# EAGLE design a111-fader (EAGLE 7.6.0)
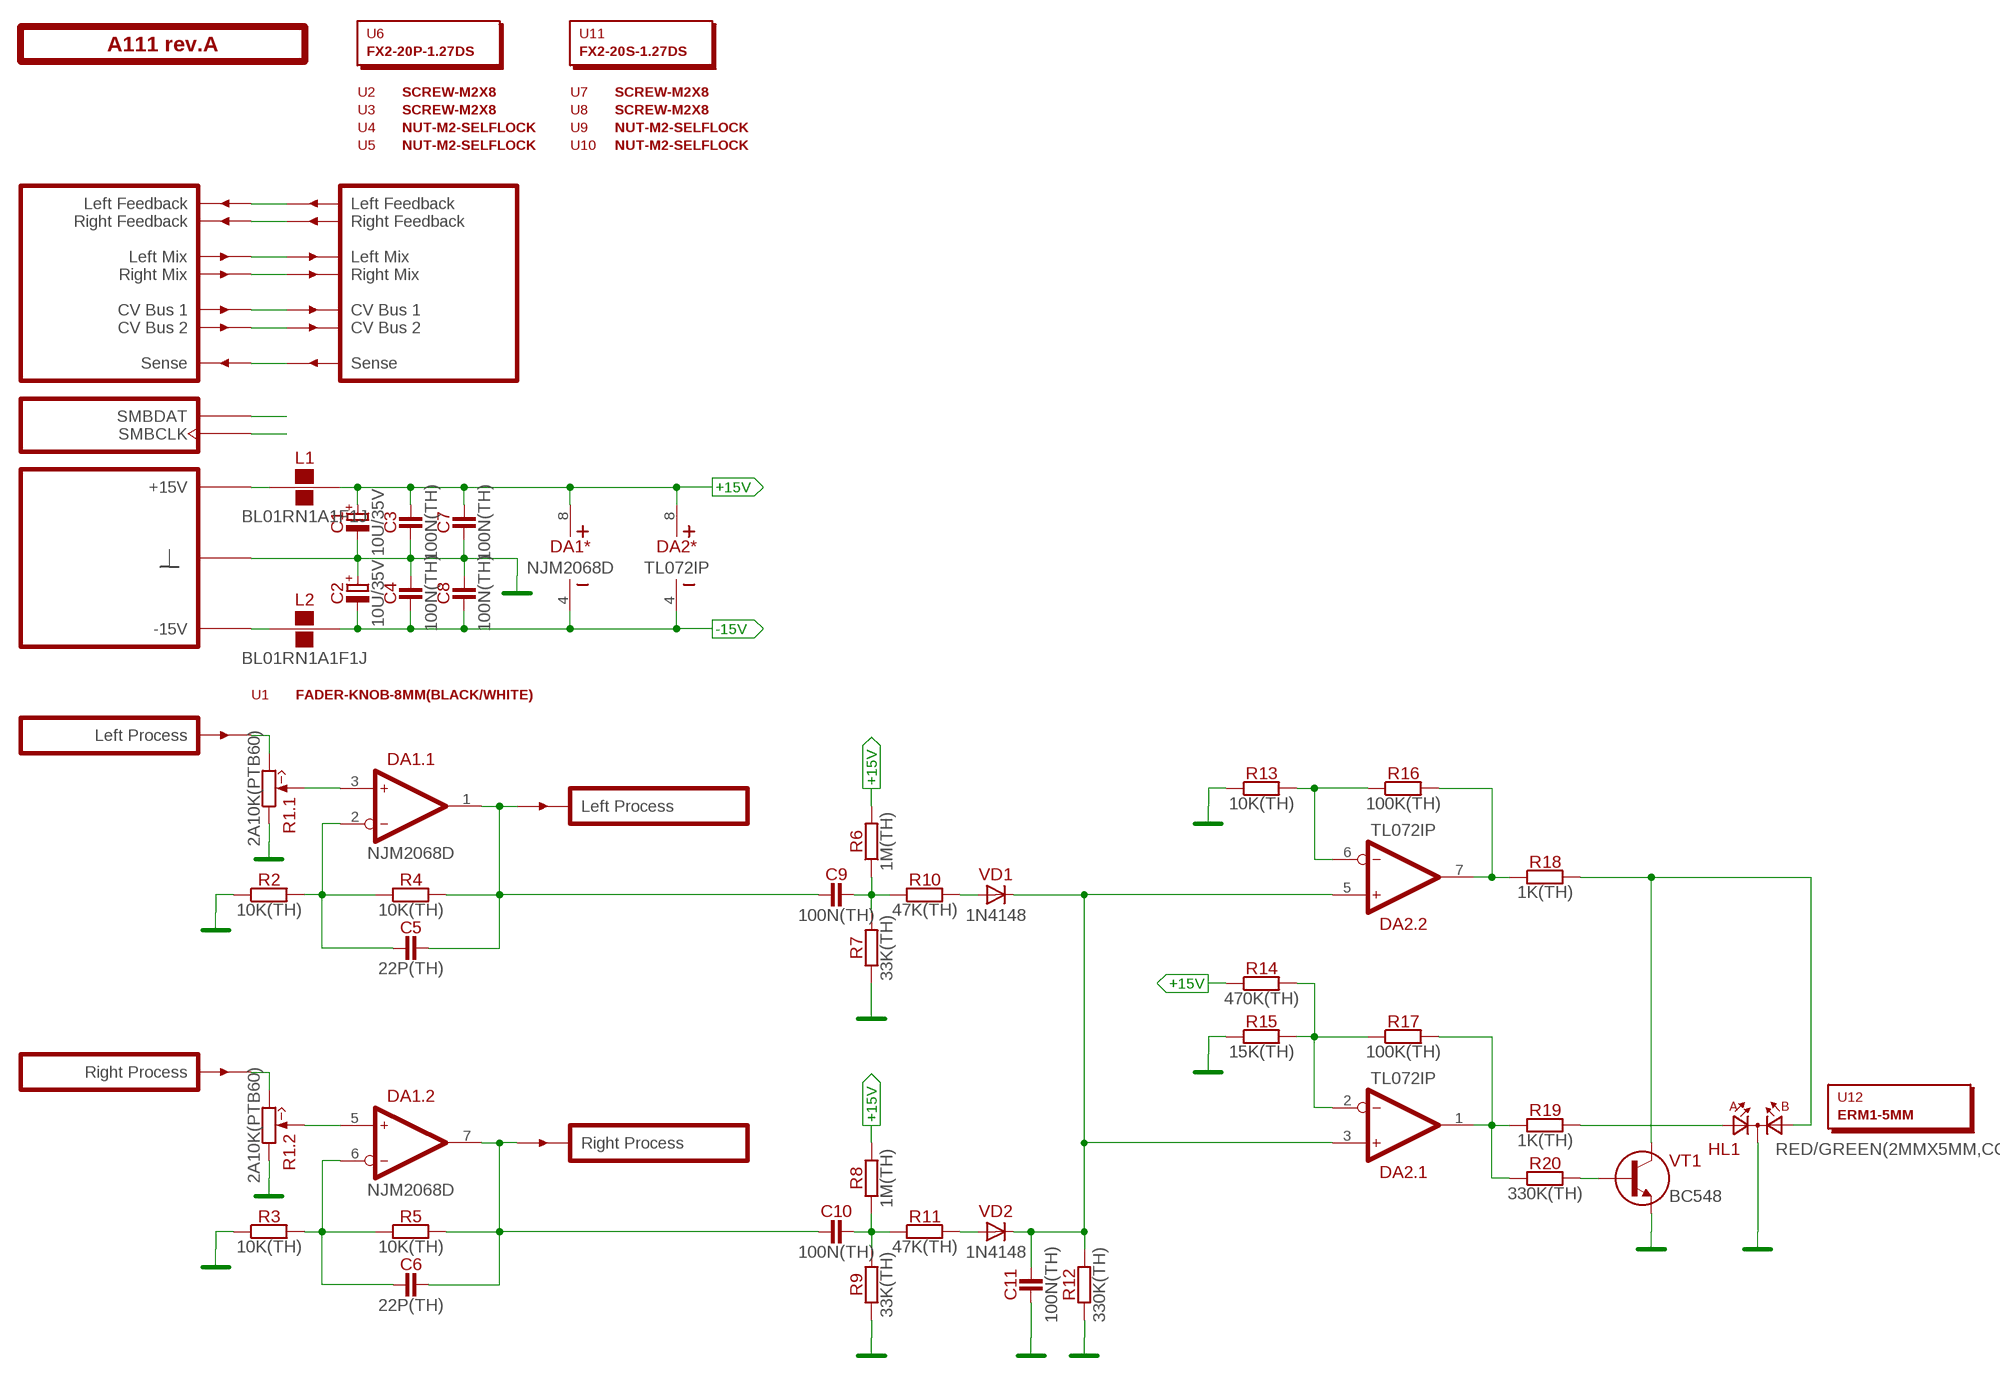
[diagram p0: schematic, sheet 1]

## Parts
C1  10U/35V  [E2-5]
C2  10U/35V  [E2-5]
C3  100N(TH)  [C050-024X044]
C4  100N(TH)  [C050-024X044]
C5  22P(TH)  [C050-024X044]
C6  22P(TH)  [C050-024X044]
C7  100N(TH)  [C050-024X044]
C8  100N(TH)  [C050-024X044]
C9  100N(TH)  [C050-024X044]
C10  100N(TH)  [C050-024X044]
C11  100N(TH)  [C050-024X044]
DA1  NJM2068D  [DIP-8]
DA2  TL072IP  [DIP-8]
HL1  RED/GREEN(2MMX5MM,CC)  [LED2X5-3PIN]
L1  BL01RN1A1F1J  [BL01RN1A]
L2  BL01RN1A1F1J  [BL01RN1A]
PCB1  A111 rev.A  ST2-BOARD-50  [ST2-BOARD-50]
R1  2A10K(PTB60)  [PTB6044]
R2  10K(TH)  [R-0207/10]
R3  10K(TH)  [R-0207/10]
R4  10K(TH)  [R-0207/10]
R5  10K(TH)  [R-0207/10]
R6  1M(TH)  [R-0207/10]
R7  33K(TH)  [R-0207/10]
R8  1M(TH)  [R-0207/10]
R9  33K(TH)  [R-0207/10]
R10  47K(TH)  [R-0207/10]
R11  47K(TH)  [R-0207/10]
R12  330K(TH)  [R-0207/10]
R13  10K(TH)  [R-0207/10]
R14  470K(TH)  [R-0207/10]
R15  15K(TH)  [R-0207/10]
R16  100K(TH)  [R-0207/10]
R17  100K(TH)  [R-0207/10]
R18  1K(TH)  [R-0207/10]
R19  1K(TH)  [R-0207/10]
R20  330K(TH)  [R-0207/10]
U1  FADER-KNOB-8MM(BLACK/WHITE)  [EMPTY]
U2  SCREW-M2X8  [EMPTY]
U3  SCREW-M2X8  [EMPTY]
U4  NUT-M2-SELFLOCK  [EMPTY]
U5  NUT-M2-SELFLOCK  [EMPTY]
U6  FX2-20P-1.27DS  [EMPTY]
U7  SCREW-M2X8  [EMPTY]
U8  SCREW-M2X8  [EMPTY]
U9  NUT-M2-SELFLOCK  [EMPTY]
U10  NUT-M2-SELFLOCK  [EMPTY]
U11  FX2-20S-1.27DS  [EMPTY]
U12  ERM1-5MM  [EMPTY]
VD1  1N4148  [DO35-7]
VD2  1N4148  [DO35-7]
VT1  BC548  [TO92]

## Nets
+15V [power]: C1.+ C3.2 C7.2 DA1.8(*:V+) DA2.8(*:V+) L1.2 R6.2 R8.2 R14.1
-15V: C2.- C4.1 C8.1 DA1.4(*:V-) DA2.4(*:V-) L2.2
GND: C1.- C2.+ C3.1 C4.2 C7.1 C8.2 C11.1 HL1.K PCB1.B4'(GND) PCB1.B4(GND) PCB1.B5'(GND) PCB1.B5(GND) PCB1.B6'(GND) PCB1.B6(GND) PCB1.B7'(GND) PCB1.B7(GND) PCB1.B8'(GND) PCB1.B8(GND) R1.A1(.1:CCW) R1.B1(.2:CCW) R2.1 R3.1 R7.1 R9.1 R12.1 R13.1 R15.1 VT1.3(E)
N$1: PCB1.ALFBK'(LFBK') PCB1.ALFBK(LFBK)
N$2: PCB1.ARFBK'(RFBK') PCB1.ARFBK(RFBK)
N$3: PCB1.ALMIX'(LMIX') PCB1.ALMIX(LMIX)
N$4: PCB1.ARMIX'(RMIX') PCB1.ARMIX(RMIX)
N$5: PCB1.ACV1'(CV1') PCB1.ACV1(CV1)
N$6: PCB1.ACV2'(CV2') PCB1.ACV2(CV2)
N$7: PCB1.BSENSE'(SENSE') PCB1.BSENSE(SENSE)
N$8: PCB1.ASMBDAT'(SMBDAT) PCB1.ASMBDAT(SMBDAT)
N$9: PCB1.ASMBCLK'(SMBCLK) PCB1.ASMBCLK(SMBCLK)
N$10: PCB1.BINL(INL) R1.A3(.1:CW)
N$11: DA1.3(.1:IN+) R1.A2(.1:W)
N$12: C5.1 DA1.2(.1:IN-) R2.2 R4.1
N$13: DA2.6(.2:IN-) R13.2 R16.1
N$14: PCB1.BINR(INR) R1.B3(.2:CW)
N$15: DA1.5(.2:IN+) R1.B2(.2:W)
N$16: C6.1 DA1.6(.2:IN-) R3.2 R5.1
N$17: DA2.7(.2:OUT) R16.2 R18.1
N$18: C6.2 C10.1 DA1.7(.2:OUT) PCB1.BOUTR'(OUTR) R5.2
N$19: C5.2 C9.1 DA1.1(.1:OUT) PCB1.BOUTL'(OUTL) R4.2
N$20: C9.2 R6.1 R7.2 R10.1
N$21: R10.2 VD1.A
N$22: C10.2 R8.1 R9.2 R11.1
N$23: R11.2 VD2.A
N$24: C11.2 DA2.3(.1:IN+) DA2.5(.2:IN+) R12.2 VD1.C VD2.C
N$25: L1.1 PCB1.A+15'(P+15V) PCB1.A+15(P+15V) PCB1.B+15'(P+15V) PCB1.B+15(P+15V)
N$29: HL1.A2 R18.2 VT1.1(C)
N$30: DA2.2(.1:IN-) R14.2 R15.2 R17.1
N$31: DA2.1(.1:OUT) R17.2 R19.1 R20.1
N$32: R20.2 VT1.2(B)
N$33: HL1.A1 R19.2
N$46: L2.1 PCB1.A-15'(P-15V) PCB1.A-15(P-15V) PCB1.B-15'(P-15V) PCB1.B-15(P-15V)

## Library data of the parts
C1 C2 = capacitors-electrolytic:?; MOUSER: 647-USW1V100MDD
C3 C4 C7-C11 = capacitors:?; MOUSER: 81-RCER71H104K0A2H3B
C5 C6 = capacitors:?
DA1 = ic-jrc:NJM2068; MOUSER: 513-NJM2068D
DA2 = ic-ti:TL072; MOUSER: 595-TL072IP
HL1 = optoelectronics:?(2MMX5MM,CC)
L1 L2 = inductors:BL01RN1A?; MOUSER: 81-BL01RN1A1F1J
PCB1 = module-footprints:ST2-BOARD-?
R1 = potentiometers:2**?(PTB60)
R2-R5 R13 = resistors:?; MOUSER: 71-RN55D-F-10K
R6-R12 R14 R15 R20 = resistors:?
R16 R17 = resistors:?; MOUSER: 71-RN55D-F-100K
R18 R19 = resistors:?; MOUSER: 71-RN55D-F-1.0K
U1-U5 U7-U10 = hardware:*?
U6 = hardware:?; MOUSER: 798-FX2-20P-1.27DS71
U11 = hardware:?; MOUSER: 798-FX2-20S-1.27DS71
U12 = hardware:?
VD1 VD2 = diodes:?; MOUSER: 583-1N4148-T
VT1 = transistors-npn:?

## Board
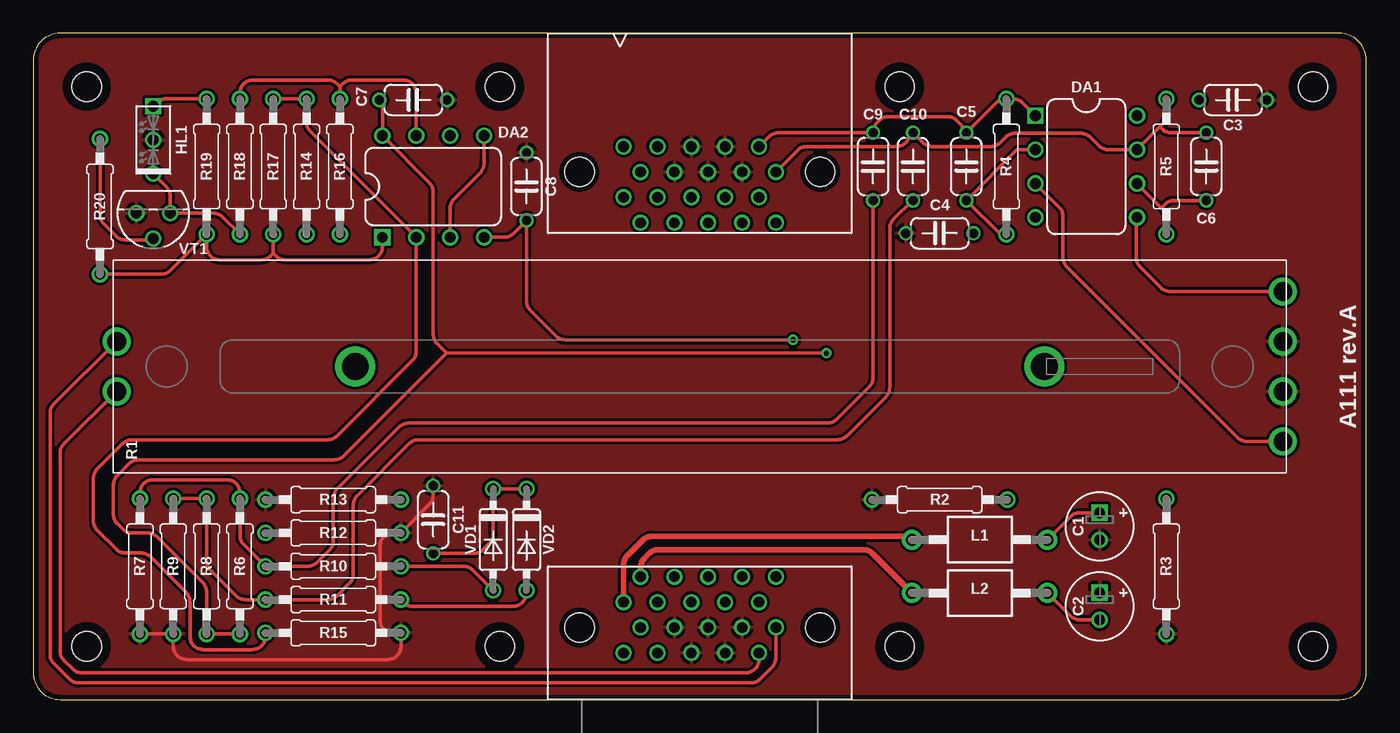
[diagram p1: board, top side]
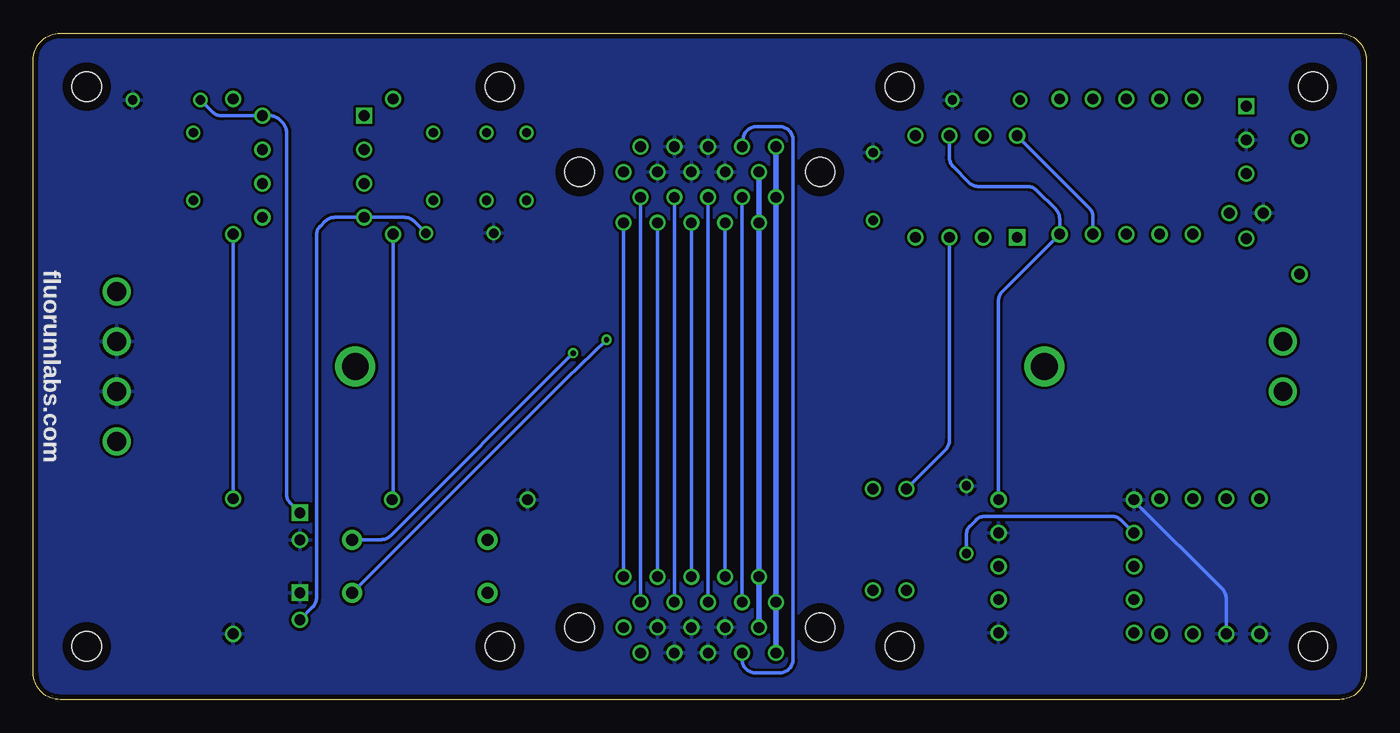
[diagram p2: board, bottom side, seen from below]

Size 100 x 50 mm. Coordinates in mm from the lower left corner, seen from the top.
Outline: 0,48 0,2 arc90 2,0 98,0 arc90 100,2 100,48 arc90 98,50 2,50 arc90 0,48
Copper layers (1*16): Top 0.0356mm / dielectric 1.5011mm / Bottom 0.0356mm
Design rules "sonictrain": minimum track width 6mil, minimum drill 13mil, track to track 8mil, track to pad 8mil, pad to pad 6mil, via to via 6mil, smd to smd 6mil, copper to edge 15mil, drill to drill 6mil, minimum pad ring 7mil, minimum via ring 7mil, stop-mask expansion 3mil, vias tented up to drill 25mil, thermal gap 10mil

### Footprints (pad centres in the part's own frame; a part is rotated, then mirrored left to right if it is on the bottom)
E2-5 = drill 0.813 square: + -1.016,0 | drill 0.813: - 1.016,0
C050-024X044 = drill 0.7: 1 -2.54,0; 2 2.54,0
DIP-8 = drill 0.813 square: 1 -3.81,-3.81 | drill 0.813: 2 -1.27,-3.81; 3 1.27,-3.81; 4 3.81,-3.81; 5 3.81,3.81; 6 1.27,3.81; 7 -1.27,3.81; 8 -3.81,3.81
LED2X5-3PIN = drill 0.813 square: A1 -2.54,0 | drill 0.813: A2 2.54,0; K 0,0
BL01RN1A = drill 0.9 pad 1.5: 1 -5.08,0; 2 5.08,0
ST2-BOARD-50 = drill 0.8: A+15 44.285,7.31; A+15' 44.285,37.69; A-15 45.555,9.215; A-15' 45.555,35.785; ACV1 51.905,7.31; ACV1' 51.905,37.69; ACV2 53.175,9.215; ACV2' 53.175,35.785; ALFBK 49.365,7.31; ALFBK' 49.365,37.69; ALMIX 46.825,7.31; ALMIX' 46.825,37.69; ARFBK 50.635,9.215; ARFBK' 50.635,35.785; ARMIX 48.095,9.215; ARMIX' 48.095,35.785; ASMBCLK 55.715,9.215; ASMBCLK' 55.715,35.785; ASMBDAT 54.445,7.31; ASMBDAT' 54.445,37.69; B4 48.095,5.405; B4' 48.095,39.595; B5 49.365,3.5; B5' 49.365,41.5; B6 50.635,5.405; B6' 50.635,39.595; B7 51.905,3.5; B7' 51.905,41.5; B8 53.175,5.405; B8' 53.175,39.595; B+15 44.285,3.5; B+15' 44.285,41.5; B-15 45.555,5.405; B-15' 45.555,39.595; BINL 54.445,3.5; BINR 55.715,5.405; BOUTL' 54.445,41.5; BOUTR' 55.715,39.595; BSENSE 46.825,3.5; BSENSE' 46.825,41.5 | hole 2.2: 4,4; 4,46; 96,4; 96,46; 35,46; 65,46; 65,4; 35,4; 59.025,5.405; 40.975,5.405; 40.975,39.595; 59.025,39.595
PTB6044 = drill 1.4: A1 -1.875,-43.75; A2 -5.625,-43.75; A3 -1.875,43.75; B1 1.875,-43.75; B2 5.625,-43.75; B3 1.875,43.75 | drill 2: S$1 0,-25.85; S$2 0,25.85
R-0207/10 = drill 0.813: 1 -5.08,0; 2 5.08,0
DO35-7 = drill 0.813: A 3.81,0; C -3.81,0
TO92 = drill 0.813: 1 -1.27,0; 2 0,1.905; 3 1.27,0

### Placement (x,y rotation side)
C1  80,13 270 top
C2  80,7 270 top
C3  90,45 180 top
C4  68,35 180 top
C5  70,40 90 top
C6  88,40 90 top
C7  28.5,45 180 top
C8  37,38.5 90 top
C9  63,40 270 top
C10  66,40 270 top
C11  30,13.5 270 top
DA1  79,40 270 top
DA2  30,38.5 0 top
HL1  9,42 270 top
L1  71,12 0 top
L2  71,8 0 top
PCB1  0,0 0 top
R1  2*A10K(PTB60)  [PTB6044]  50,25 90 top
R2  68,15 0 top
R3  85,10 90 top
R4  73,40 90 top
R5  85,40 90 top
R6  15.5,10 270 top
R7  8,10 90 top
R8  13,10 270 top
R9  10.5,10 90 top
R10  22.5,10 0 top
R11  22.5,7.5 0 top
R12  22.5,12.5 180 top
R13  22.5,15 0 top
R14  20.5,40 90 top
R15  22.5,5 180 top
R16  23,40 90 top
R17  18,40 270 top
R18  15.5,40 270 top
R19  13,40 90 top
R20  5,37 90 top
U1  3,-154 0 top  (outside the outline)
U2  28,-174 0 top  (outside the outline)
U3  31,-174 0 top  (outside the outline)
U4  34,-174 0 top  (outside the outline)
U5  37,-174 0 top  (outside the outline)
U6  40,-174 0 top  (outside the outline)
U7  43,-174 0 top  (outside the outline)
U8  46,-174 0 top  (outside the outline)
U9  49,-174 0 top  (outside the outline)
U10  52,-174 0 top  (outside the outline)
U11  55,-174 0 top  (outside the outline)
U12  58,-174 0 top  (outside the outline)
VD1  34.5,12 270 top
VD2  37,12 270 top
VT1  9,36.5 180 top

### Tracks (layer width: path | path; a pad name or v marks a point on that pad's centre or on a via)
+15V  (via drill 0.4)
  Top 0.254: C1.+ 78.51,14.02 arc45 77.8,13.72 L1.2 | 31,26 v59.5,26 | C7.2 26.19,44.77 DA2.8 29.71,38.79 arc-45 30,38.09 30,27.41 arc45 30.29,26.71 31,26 | R6.2 R8.2 13,8.09 arc45 12.71,8.79 9.29,12.21 arc45 8.59,12.5 7.41,12.5 arc-45 6.71,12.79 6.29,13.21 arc-45 6,13.91 6,16.09 arc-45 6.29,16.79 7.21,17.71 arc-45 7.91,18 22.59,18 arc45 23.29,18.29 31,26
  Bottom 0.254: C3.2 86.56,44.1 arc-45 85.86,43.81 DA1.8 82.22,43.81 arc45 81.52,43.52 81.29,43.29 arc45 81,42.59 81,15.43 arc-45 80.71,14.72 C1.+ | v59.5,26 73.21,12.29 arc45 73.91,12 L1.2 | R14.1 20.5,36.21 arc-45 20.79,36.91 DA2.8
-15V  (via drill 0.4)
  Top 0.254: C2.- 78.51,5.98 arc-45 77.8,6.28 L2.2 | DA2.4 35.32,34.69 arc45 36.02,34.98 C8.1 37,29.91 arc45 37.29,29.21 39.21,27.29 arc45 39.91,27 v57,27
  Bottom 0.254: C4.1 71.44,35.9 arc-45 72.14,36.19 DA1.4 77.4,36.19 arc-45 78.1,35.9 78.46,35.54 arc-45 78.75,34.84 78.75,7.65 arc45 79.04,6.94 C2.- | v57,27 60,24.08 L2.2
GND
  Top 0.254: R7.1 R9.1 10.5,4 arc90 11.5,3 26.58,3 arc90 27.58,4 R15.1 27,5 arc-90 26,6 26,11.5 arc-90 27,12.5 R12.1 29.71,14.63 arc45 30,15.33 C11.1
  Bottom 0.254: R13.1 17.42,14.92 10.79,8.29 arc45 10.5,7.59 R9.1
  pour Bottom: 0,50 100,50 100,0 0,0
  pour Top: 0,50 100,50 100,0 0,0
N$1
  Bottom 0.254: PCB1.ALFBK' PCB1.ALFBK
N$2
  Bottom 0.254: PCB1.ARFBK PCB1.ARFBK'
N$3
  Bottom 0.254: PCB1.ALMIX' PCB1.ALMIX
N$4
  Bottom 0.254: PCB1.ARMIX PCB1.ARMIX'
N$5
  Bottom 0.254: PCB1.ACV1' PCB1.ACV1
N$6
  Bottom 0.254: PCB1.ACV2 PCB1.ACV2'
N$7
  Bottom 0.254: PCB1.BSENSE 46.83,3 arc-90 45.83,2 44,2 arc-90 43,3 43,42 arc-90 44,43 45.75,43 arc-90 46.75,42 46.75,41.58 PCB1.BSENSE'
N$8
  Bottom 0.254: PCB1.ASMBDAT' PCB1.ASMBDAT
N$9
  Bottom 0.254: PCB1.ASMBCLK PCB1.ASMBCLK'
N$10
  Top 0.254: PCB1.BINL 54.45,3 arc-90 53.45,2 3.66,2 arc-45 2.96,2.29 2.29,2.96 arc-45 2,3.66 2,18.46 arc-45 2.29,19.17 R1.A3
N$11
  Top 0.254: R1.A2 91.04,19.38 arc-45 90.33,19.67 77.54,32.46 arc-45 77.25,33.16 77.25,36.26 arc45 76.96,36.96 DA1.3
N$12
  Top 0.254: DA1.2 73.81,41.27 C5.1 72.54,34.92 R4.1
  Bottom 0.254: R4.1 73,15.08 R2.2
N$13
  Bottom 0.254: DA2.6 31.27,40.68 arc-45 30.98,39.98 29.79,38.79 arc-45 29.09,38.5 25.41,38.5 arc45 24.71,38.21 23.29,36.79 arc45 23,36.09 R16.1 27.29,30.63 arc-45 27.58,29.93 R13.2
N$14
  Top 0.254: PCB1.BINR 55.72,3.13 arc-45 55.42,2.42 54.54,1.54 arc-45 53.84,1.25 3.41,1.25 arc-45 2.71,1.54 1.54,2.71 arc-45 1.25,3.41 1.25,21.46 arc-45 1.54,22.17 R1.B3
N$15
  Top 0.254: R1.B2 85.29,30.62 arc-45 84.58,30.92 83.04,32.46 arc-45 82.75,33.16 82.75,36.13 DA1.5
N$16
  Top 0.254: R5.1 85,36.13 arc45 84.71,36.83 84.64,36.9 | 84.64,36.9 DA1.6 | C6.1 85.62,37.46 arc45 84.92,37.17 84.64,36.9
  Bottom 0.254: R5.1 R3.2
N$17
  Top 0.254: R18.1 15.5,45.5 arc-90 16.5,46.5 22.09,46.5 arc-45 22.79,46.21 23,46 | 23,46 R16.2 | DA2.7 28.73,45.5 arc90 27.73,46.5 23.91,46.5 arc45 23.21,46.21 23,46
N$18
  Top 0.254: R5.2 85,43.87 arc-45 84.71,43.17 84.52,42.98 | 84.52,42.98 DA1.7 80.64,41.27 arc-45 79.94,41.56 79.29,42.21 arc45 78.59,42.5 73.66,42.5 arc45 72.96,42.21 72.54,41.79 arc-45 71.84,41.5 67.45,41.5 arc-45 66.75,41.79 C10.1 66,42.5 65.55,41.9 arc-53 64.75,41.5 58.03,41.5 arc45 57.33,41.21 PCB1.BOUTR' | C6.2 85.37,42.54 arc-45 84.67,42.83 84.52,42.98
N$19
  Top 0.254: PCB1.BOUTL' 55.19,42.25 arc-45 55.9,42.54 C9.1 63,42.59 arc-45 63.29,43.29 63.46,43.46 arc-45 64.16,43.75 68.59,43.75 arc-45 69.29,43.46 69.6,43.15 arc-45 69.75,42.79 C5.2 72.25,44.79 arc-45 72.95,45.08 R4.2 73.51,45.08 arc-45 74.21,44.79 DA1.1
N$20
  Top 0.254: C9.2 63,24.16 arc-45 62.71,23.46 60.29,21.04 arc-45 59.59,20.75 28.16,20.75 arc45 27.46,20.46 22.79,15.79 arc45 22.5,15.09 22.5,11.91 arc-45 22.21,11.21 21.29,10.29 arc-45 20.59,10 R10.1 15.79,11.63 arc-45 15.5,12.33 R6.1 15.5,15.5 arc90 14.5,16.5 9,16.5 arc90 8,15.5 R7.2
N$21
  Top 0.254: R10.2 32.28,10 arc-45 32.98,9.71 VD1.A
N$22
  Top 0.254: C10.2 65.96,37.46 64.54,36.04 arc45 64.25,35.34 64.25,23.41 arc-45 63.96,22.71 61.04,19.79 arc-45 60.34,19.5 28.91,19.5 arc45 28.21,19.21 24.29,15.29 arc45 24,14.59 24,9.41 arc-45 23.71,8.71 22.79,7.79 arc-45 22.09,7.5 R11.1 15.91,7.5 arc-45 15.21,7.79 13.29,9.71 arc-45 13,10.41 R8.1 R9.2
N$23
  Top 0.254: R11.2 27.58,7.42 27.71,7.29 arc45 28.41,7 36,7 arc90 37,8 VD2.A
N$24
  Top 0.254: DA2.3 31.27,36.86 arc-45 31.56,37.56 33.52,39.52 arc45 33.81,40.22 DA2.5 | VD2.C VD1.C 34.5,12.41 arc-45 34.21,11.71 33.75,11.25 arc-45 33.05,10.96 C11.2
  Bottom 0.254: DA2.3 31.27,19.45 arc45 31.56,18.75 VD1.C | C11.2 30,12.34 arc45 29.71,13.04 29.29,13.46 arc45 28.59,13.75 19.08,13.75 arc45 18.38,13.46 R12.2
N$25
  Top 0.406: PCB1.A+15 44.28,10.12 arc-45 44.58,10.83 45.71,11.96 arc-45 46.41,12.25 65.67,12.25 L1.1
  Bottom 0.406: PCB1.B+15 PCB1.A+15 PCB1.A+15' PCB1.B+15'
N$29
  Top 0.254: R18.2 14.21,36.21 arc45 13.51,36.5 VT1.1 10.27,37.78 arc45 9.98,38.48 HL1.A2
N$30
  Top 0.254: R17.1 R14.2 20.5,43.33 arc45 20.79,42.63 DA2.2 28.73,26.14 arc-45 28.44,25.44 22.79,19.79 arc-45 22.09,19.5 7.41,19.5 arc45 6.71,19.21 4.79,17.29 arc45 4.5,16.59 4.5,13.41 arc45 4.79,12.71 6.21,11.29 arc45 6.91,11 8.09,11 arc-45 8.79,10.71 11.46,8.04 arc-45 11.75,7.34 11.75,4.75 arc90 12.75,3.75 16.42,3.75 arc90 17.42,4.75 R15.2
N$31
  Top 0.254: DA2.1 26.19,34 arc-90 25.19,33 18.91,33 arc-45 18.21,33.29 18,33.5 | 18,33.5 R17.2 | R20.1 9.59,31.92 arc45 10.29,32.21 R19.1 13,34 arc90 14,33 17.09,33 arc45 17.79,33.29 18,33.5
N$32
  Top 0.254: R20.2 5,36.41 arc45 5.29,35.71 6.21,34.79 arc45 6.91,34.5 8.9,34.5 VT1.2
N$33
  Top 0.254: R19.2 9.95,45.08 arc45 9.25,44.79 HL1.A1
N$46
  Top 0.406: PCB1.A-15 45.55,9.89 arc-45 45.85,10.6 46.21,10.96 arc-45 46.91,11.25 62.26,11.25 arc-45 62.96,10.96 L2.1
  Bottom 0.406: PCB1.B-15' PCB1.A-15' PCB1.A-15 PCB1.B-15